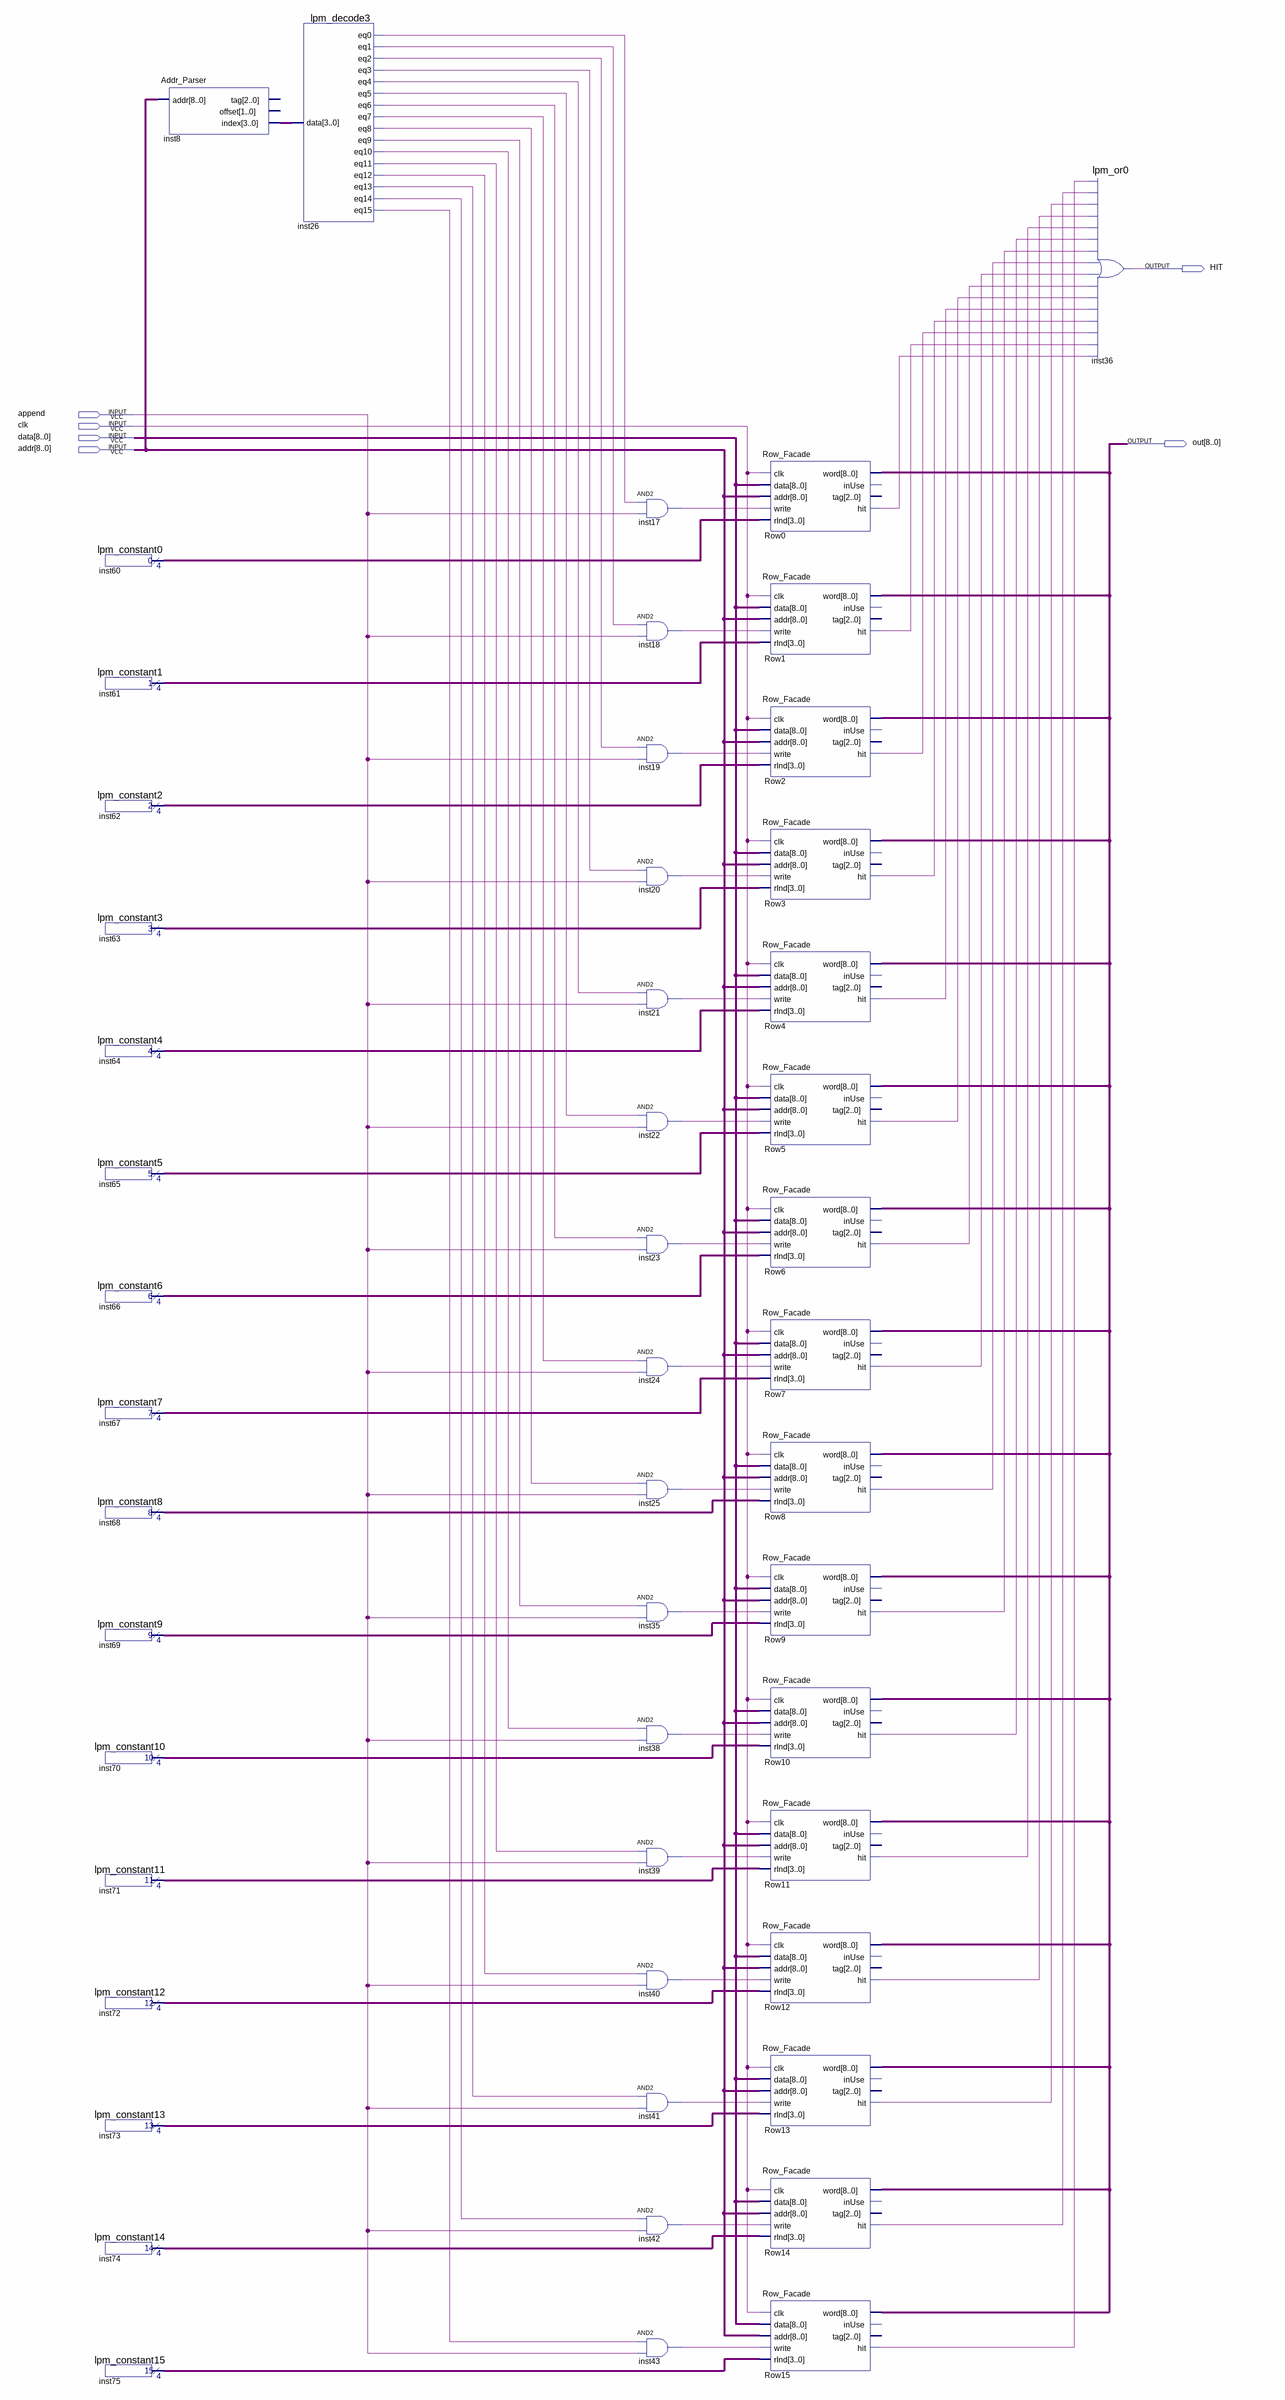
[diagram p0: schematic sheet]
// Quartus schematic Cash.bdf as structural Verilog: 51 symbols, 6 pins
module Cash (
  input  append,
  input  clk,
  input  [8:0] data,
  input  [8:0] addr,
  output HIT,
  output [8:0] out
);

  wire inst17_out, inst18_out, inst19_out, inst20_out, inst21_out, inst22_out, inst23_out, inst24_out,
       inst25_out, inst26_eq0, inst26_eq1, inst26_eq2, inst26_eq3, inst26_eq4, inst26_eq5, inst26_eq6,
       inst26_eq7, inst26_eq8, inst26_eq9, inst26_eq10, inst26_eq11, inst26_eq12, inst26_eq13, inst26_eq14,
       inst26_eq15, inst35_out, inst38_out, inst39_out, inst40_out, inst41_out, inst42_out, inst43_out,
       Row0_hit, Row1_hit, Row2_hit, Row3_hit, Row4_hit, Row5_hit, Row6_hit, Row7_hit, Row8_hit, Row9_hit,
       Row10_hit, Row11_hit, Row12_hit, Row13_hit, Row14_hit, Row15_hit;
  wire [3:0] inst8_index, inst60_result, inst61_result, inst62_result, inst63_result, inst64_result,
       inst65_result, inst66_result, inst67_result, inst68_result, inst69_result, inst70_result,
       inst71_result, inst72_result, inst73_result, inst74_result, inst75_result;

  lpm_constant0 inst60 (.result(inst60_result));
  lpm_constant1 inst61 (.result(inst61_result));
  lpm_constant2 inst62 (.result(inst62_result));
  lpm_constant3 inst63 (.result(inst63_result));
  lpm_constant4 inst64 (.result(inst64_result));
  lpm_constant5 inst65 (.result(inst65_result));
  lpm_constant6 inst66 (.result(inst66_result));
  lpm_constant7 inst67 (.result(inst67_result));
  lpm_constant8 inst68 (.result(inst68_result));
  lpm_constant9 inst69 (.result(inst69_result));
  lpm_constant10 inst70 (.result(inst70_result));
  lpm_constant11 inst71 (.result(inst71_result));
  lpm_constant12 inst72 (.result(inst72_result));
  lpm_constant13 inst73 (.result(inst73_result));
  lpm_constant14 inst74 (.result(inst74_result));
  lpm_constant15 inst75 (.result(inst75_result));
  Addr_Parser inst8 (.addr(addr), .index(inst8_index));  // open: tag, offset
  lpm_decode3 inst26 (
    .data(inst8_index), .eq0(inst26_eq0), .eq1(inst26_eq1), .eq2(inst26_eq2), .eq3(inst26_eq3),
    .eq4(inst26_eq4), .eq5(inst26_eq5), .eq6(inst26_eq6), .eq7(inst26_eq7), .eq8(inst26_eq8),
    .eq9(inst26_eq9), .eq10(inst26_eq10), .eq11(inst26_eq11), .eq12(inst26_eq12), .eq13(inst26_eq13),
    .eq14(inst26_eq14), .eq15(inst26_eq15));
  and inst17 (inst17_out, inst26_eq0, append);
  and inst18 (inst18_out, inst26_eq1, append);
  and inst19 (inst19_out, inst26_eq2, append);
  and inst20 (inst20_out, inst26_eq3, append);
  and inst21 (inst21_out, inst26_eq4, append);
  and inst22 (inst22_out, inst26_eq5, append);
  and inst23 (inst23_out, inst26_eq6, append);
  and inst24 (inst24_out, inst26_eq7, append);
  and inst25 (inst25_out, inst26_eq8, append);
  and inst35 (inst35_out, inst26_eq9, append);
  and inst38 (inst38_out, inst26_eq10, append);
  and inst39 (inst39_out, inst26_eq11, append);
  and inst40 (inst40_out, inst26_eq12, append);
  and inst41 (inst41_out, inst26_eq13, append);
  and inst42 (inst42_out, inst26_eq14, append);
  and inst43 (inst43_out, inst26_eq15, append);
  Row_Facade Row0 (
    .clk(clk), .data(data), .addr(addr), .write(inst17_out), .rInd(inst60_result), .word(out), .hit(Row0_hit));  // open: inUse, tag
  Row_Facade Row1 (
    .clk(clk), .data(data), .addr(addr), .write(inst18_out), .rInd(inst61_result), .word(out), .hit(Row1_hit));  // open: inUse, tag
  Row_Facade Row2 (
    .clk(clk), .data(data), .addr(addr), .write(inst19_out), .rInd(inst62_result), .word(out), .hit(Row2_hit));  // open: inUse, tag
  Row_Facade Row3 (
    .clk(clk), .data(data), .addr(addr), .write(inst20_out), .rInd(inst63_result), .word(out), .hit(Row3_hit));  // open: inUse, tag
  Row_Facade Row4 (
    .clk(clk), .data(data), .addr(addr), .write(inst21_out), .rInd(inst64_result), .word(out), .hit(Row4_hit));  // open: inUse, tag
  Row_Facade Row5 (
    .clk(clk), .data(data), .addr(addr), .write(inst22_out), .rInd(inst65_result), .word(out), .hit(Row5_hit));  // open: inUse, tag
  Row_Facade Row6 (
    .clk(clk), .data(data), .addr(addr), .write(inst23_out), .rInd(inst66_result), .word(out), .hit(Row6_hit));  // open: inUse, tag
  Row_Facade Row7 (
    .clk(clk), .data(data), .addr(addr), .write(inst24_out), .rInd(inst67_result), .word(out), .hit(Row7_hit));  // open: inUse, tag
  Row_Facade Row8 (
    .clk(clk), .data(data), .addr(addr), .write(inst25_out), .rInd(inst68_result), .word(out), .hit(Row8_hit));  // open: inUse, tag
  Row_Facade Row9 (
    .clk(clk), .data(data), .addr(addr), .write(inst35_out), .rInd(inst69_result), .word(out), .hit(Row9_hit));  // open: inUse, tag
  Row_Facade Row10 (
    .clk(clk), .data(data), .addr(addr), .write(inst38_out), .rInd(inst70_result), .word(out), .hit(Row10_hit));  // open: inUse, tag
  Row_Facade Row11 (
    .clk(clk), .data(data), .addr(addr), .write(inst39_out), .rInd(inst71_result), .word(out), .hit(Row11_hit));  // open: inUse, tag
  Row_Facade Row12 (
    .clk(clk), .data(data), .addr(addr), .write(inst40_out), .rInd(inst72_result), .word(out), .hit(Row12_hit));  // open: inUse, tag
  Row_Facade Row13 (
    .clk(clk), .data(data), .addr(addr), .write(inst41_out), .rInd(inst73_result), .word(out), .hit(Row13_hit));  // open: inUse, tag
  Row_Facade Row14 (
    .clk(clk), .data(data), .addr(addr), .write(inst42_out), .rInd(inst74_result), .word(out), .hit(Row14_hit));  // open: inUse, tag
  Row_Facade Row15 (
    .clk(clk), .data(data), .addr(addr), .write(inst43_out), .rInd(inst75_result), .word(out), .hit(Row15_hit));  // open: inUse, tag
  lpm_or0 inst36 (
    .data0(Row15_hit), .data1(Row14_hit), .data2(Row13_hit), .data3(Row12_hit), .data4(Row11_hit),
    .data5(Row10_hit), .data6(Row9_hit), .data7(Row8_hit), .data8(Row7_hit), .data9(Row6_hit),
    .data10(Row5_hit), .data11(Row4_hit), .data12(Row3_hit), .data13(Row2_hit), .data14(Row1_hit),
    .data15(Row0_hit), .result(HIT));
endmodule
